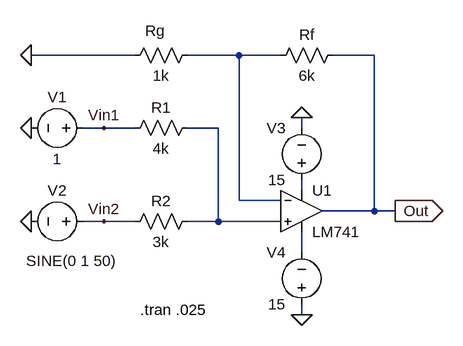
[diagram p0: schematic LAB5_OPAMP_Non_inverted_Adder_Fin.asc]
LAB5_OPAMP_Non_inverted_Adder_Fin.asc, the LTspice schematic file:
Version 4
SHEET 1 880 680
WIRE -16 -48 -176 -48
WIRE 144 -48 64 -48
WIRE 208 -48 144 -48
WIRE 352 -48 288 -48
WIRE -64 64 -96 64
WIRE -16 64 -64 64
WIRE 112 64 64 64
WIRE 240 64 240 48
WIRE 240 160 240 144
WIRE 144 176 144 -48
WIRE 208 176 144 176
WIRE 352 192 352 -48
WIRE 352 192 272 192
WIRE 384 192 352 192
WIRE -64 208 -96 208
WIRE -16 208 -64 208
WIRE 112 208 112 64
WIRE 112 208 64 208
WIRE 208 208 112 208
WIRE 240 256 240 224
WIRE 240 352 240 336
FLAG 240 48 0
FLAG 240 352 0
FLAG -176 64 0
FLAG -176 208 0
FLAG 384 192 Out
IOPIN 384 192 Out
FLAG -176 -48 0
FLAG -64 64 Vin1
FLAG -64 208 Vin2
SYMBOL OpAmps\\LM741 240 128 R0
SYMATTR InstName U1
SYMBOL voltage 240 352 R180
WINDOW 0 24 96 Left 2
WINDOW 3 24 16 Left 2
WINDOW 123 0 0 Left 0
WINDOW 39 0 0 Left 0
SYMATTR InstName V4
SYMATTR Value 15
SYMBOL voltage 240 160 R180
WINDOW 0 24 96 Left 2
WINDOW 3 24 16 Left 2
WINDOW 123 0 0 Left 0
WINDOW 39 0 0 Left 0
SYMATTR InstName V3
SYMATTR Value 15
SYMBOL res 80 192 R90
WINDOW 0 0 56 VBottom 2
WINDOW 3 32 56 VTop 2
SYMATTR InstName R2
SYMATTR Value 3k
SYMBOL res 80 48 R90
WINDOW 0 0 56 VBottom 2
WINDOW 3 32 56 VTop 2
SYMATTR InstName R1
SYMATTR Value 4k
SYMBOL voltage -80 64 R90
WINDOW 0 -32 56 VBottom 2
WINDOW 3 32 56 VTop 2
WINDOW 123 0 0 Left 0
WINDOW 39 0 0 Left 0
SYMATTR InstName V1
SYMATTR Value 1
SYMBOL voltage -80 208 R90
WINDOW 0 -32 56 VBottom 2
WINDOW 3 45 34 VTop 2
WINDOW 123 0 0 Left 0
WINDOW 39 0 0 Left 0
SYMATTR InstName V2
SYMATTR Value SINE(0 1 50)
SYMBOL res 304 -64 R90
WINDOW 0 0 56 VBottom 2
WINDOW 3 32 56 VTop 2
SYMATTR InstName Rf
SYMATTR Value 6k
SYMBOL res 80 -64 R90
WINDOW 0 -6 65 VBottom 2
WINDOW 3 32 56 VTop 2
SYMATTR InstName Rg
SYMATTR Value 1k
TEXT -8 344 Left 2 !.tran .025

The netlist it stands for:
* LAB5_OPAMP_Non_inverted_Adder_Fin.asc
XU1 N002 N001 N003 N004 Out LM741  ; pins In+ In- V+ V- OUT
V4 0 N004 15
V3 N003 0 15
R2 N002 Vin2 3k
R1 N002 Vin1 4k
V1 Vin1 0 1
V2 Vin2 0 SINE(0 1 50)
Rf Out N001 6k
Rg N001 0 1k
.tran .025
.lib LM741.lib
.backanno
.end